# Altium schematic sheet CR95HF_nfc_simple.SchDoc
size A4
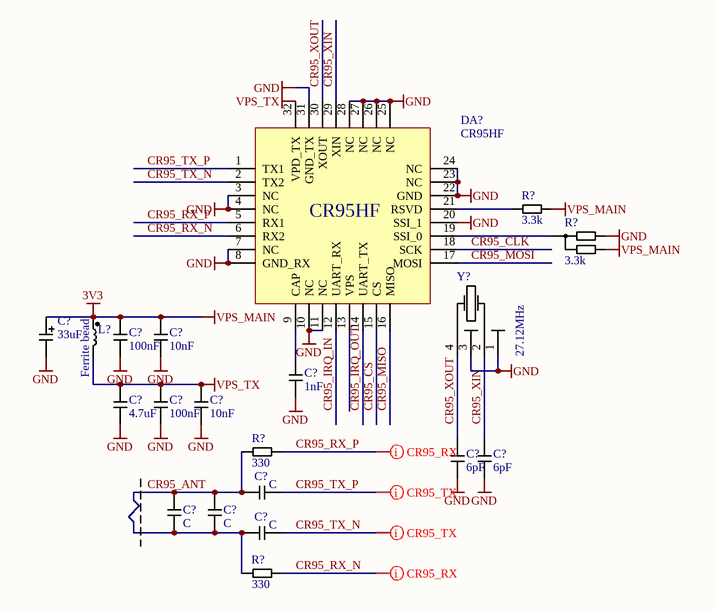
[diagram p0: CR95HF_nfc_simple.SchDoc]

## Parts
(Parts that share a designator on the sheet are numbered #1, #2 ... from top to bottom, then left to right.)
C?#1  33uF  [SMD A]
C?#2  100nF  [C0603]
C?#3  10nF  [C0603]
C?#4  1nF  [C0603]
C?#5  4.7uF  [C0603]
C?#6  100nF  [C0603]
C?#7  10nF  [C0603]
C?#8  6pF  [C0603]
C?#9  6pF  [C0603]
C?#10  C  [C0603]
C?#11  C  [C0603]
C?#12  C  [C0603]
C?#13  C  [C0603]
DA?  CR95HF  [VFQFPN-32]
L?  Ferrite bead  [L0805]
R?#1  3.3k  [R0603]
R?#2  3.3k  [R0603_CHOISE]
R?#3  330  [R0603]
R?#4  330  [R0603]
Y?  27.12MHz  [Xtal 0532]

## Nets
3V3: C?#1.1 C?#2.1 C?#3.1 L?.1 R?#1.2 R?#2.3  [also labelled VPS_MAIN]
GND: C?#1.2 C?#2.2 C?#3.2 C?#4.2 C?#5.2 C?#6.2 C?#7.2 C?#8.2 C?#9.2 DA?.3(NC) DA?.4(NC) DA?.7(NC) DA?.8(GND_RX) DA?.10(NC) DA?.11(NC) DA?.20(SSI_1) DA?.22(GND) DA?.23(NC) DA?.24(NC) DA?.25(NC) DA?.26(NC) DA?.27(NC) DA?.28(NC) DA?.31(GND_TX) R?#2.1 Y?.1(X1) Y?.3(X2)
VPS_TX: C?#5.1 C?#6.1 C?#7.1 DA?.32(VPD_TX) L?.2
CR95_ANT: C?#10.1 C?#11.1 C?#11.2 C?#12.1 C?#12.2 C?#13.1 R?#3.1 R?#4.1
CR95_CLK: DA?.18(SCK)
CR95_CS: DA?.15(CS)
CR95_IRQ_IN: DA?.12(UART_RX)
CR95_IRQ_OUT: DA?.14(UART_TX)
CR95_MISO: DA?.16(MISO)
CR95_MOSI: DA?.17(MOSI)
CR95_RX_N: DA?.6(RX2) R?#4.2
CR95_RX_P: DA?.5(RX1) R?#3.2
CR95_TX_N: C?#13.2 DA?.2(TX2)
CR95_TX_P: C?#10.2 DA?.1(TX1)
CR95_XIN: C?#9.1 DA?.29(XIN) Y?.2(GND)
CR95_XOUT: C?#8.1 DA?.30(XOUT) Y?.4(GND)
NetC?#4_1: C?#4.1 DA?.9(CAP)
NetDA?_19: DA?.19(SSI_0) R?#2.2
NetDA?_21: DA?.21(RSVD) R?#1.1

Not connected (* = marked no-connect by the designer): DA? 13(VPS)

## Layout directives
differential pair: CR95_RX_N, CR95_RX_P, CR95_TX_N, CR95_TX_P

## Library data of the parts
C?#1 = CP: Capacitor polarized
C?#2-C?#13 = C: Capacitor
DA? = CR95HF: RFID IC with SPI/UART
L? = L: Inductor
R?#1 R?#3 R?#4 = R: Resistor
R?#2 = R_Choise: R for choise
Y? = Xtal: Quartz crystal